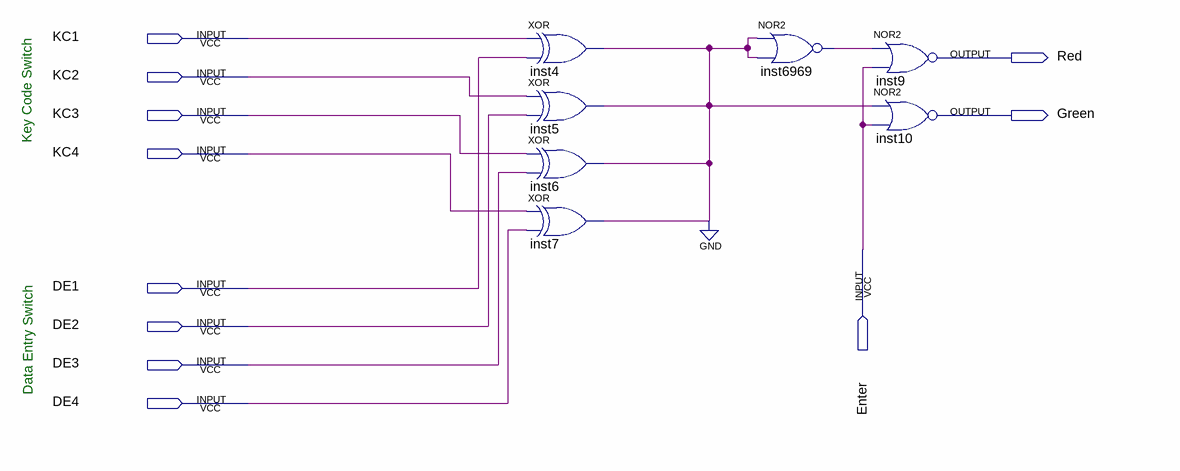
[diagram p0: schematic sheet]
// Quartus schematic digilock.bdf as structural Verilog: 7 symbols, 11 pins
module digilock (
  input  KC1,
  input  KC2,
  input  KC3,
  input  KC4,
  input  Enter,
  input  DE1,
  input  DE2,
  input  DE3,
  input  DE4,
  output Red,
  output Green
);

  wire inst4_out, inst6969_out;

  xor inst4 (inst4_out, KC1, DE1);
  xor inst5 (inst4_out, KC2, DE2);
  xor inst6 (inst4_out, KC3, DE3);
  xor inst7 (inst4_out, KC4, DE4);
  nor inst6969 (inst6969_out, inst4_out, inst4_out);
  nor inst9 (Red, inst6969_out, Enter);
  nor inst10 (Green, inst4_out, Enter);
  // also tied to GND on the sheet: inst4_out

  // Notes on the sheet:
  //   Key Code Switch
  //   Data Entry Switch
endmodule
